# Altium schematic sheet MPU.SchDoc
size A3
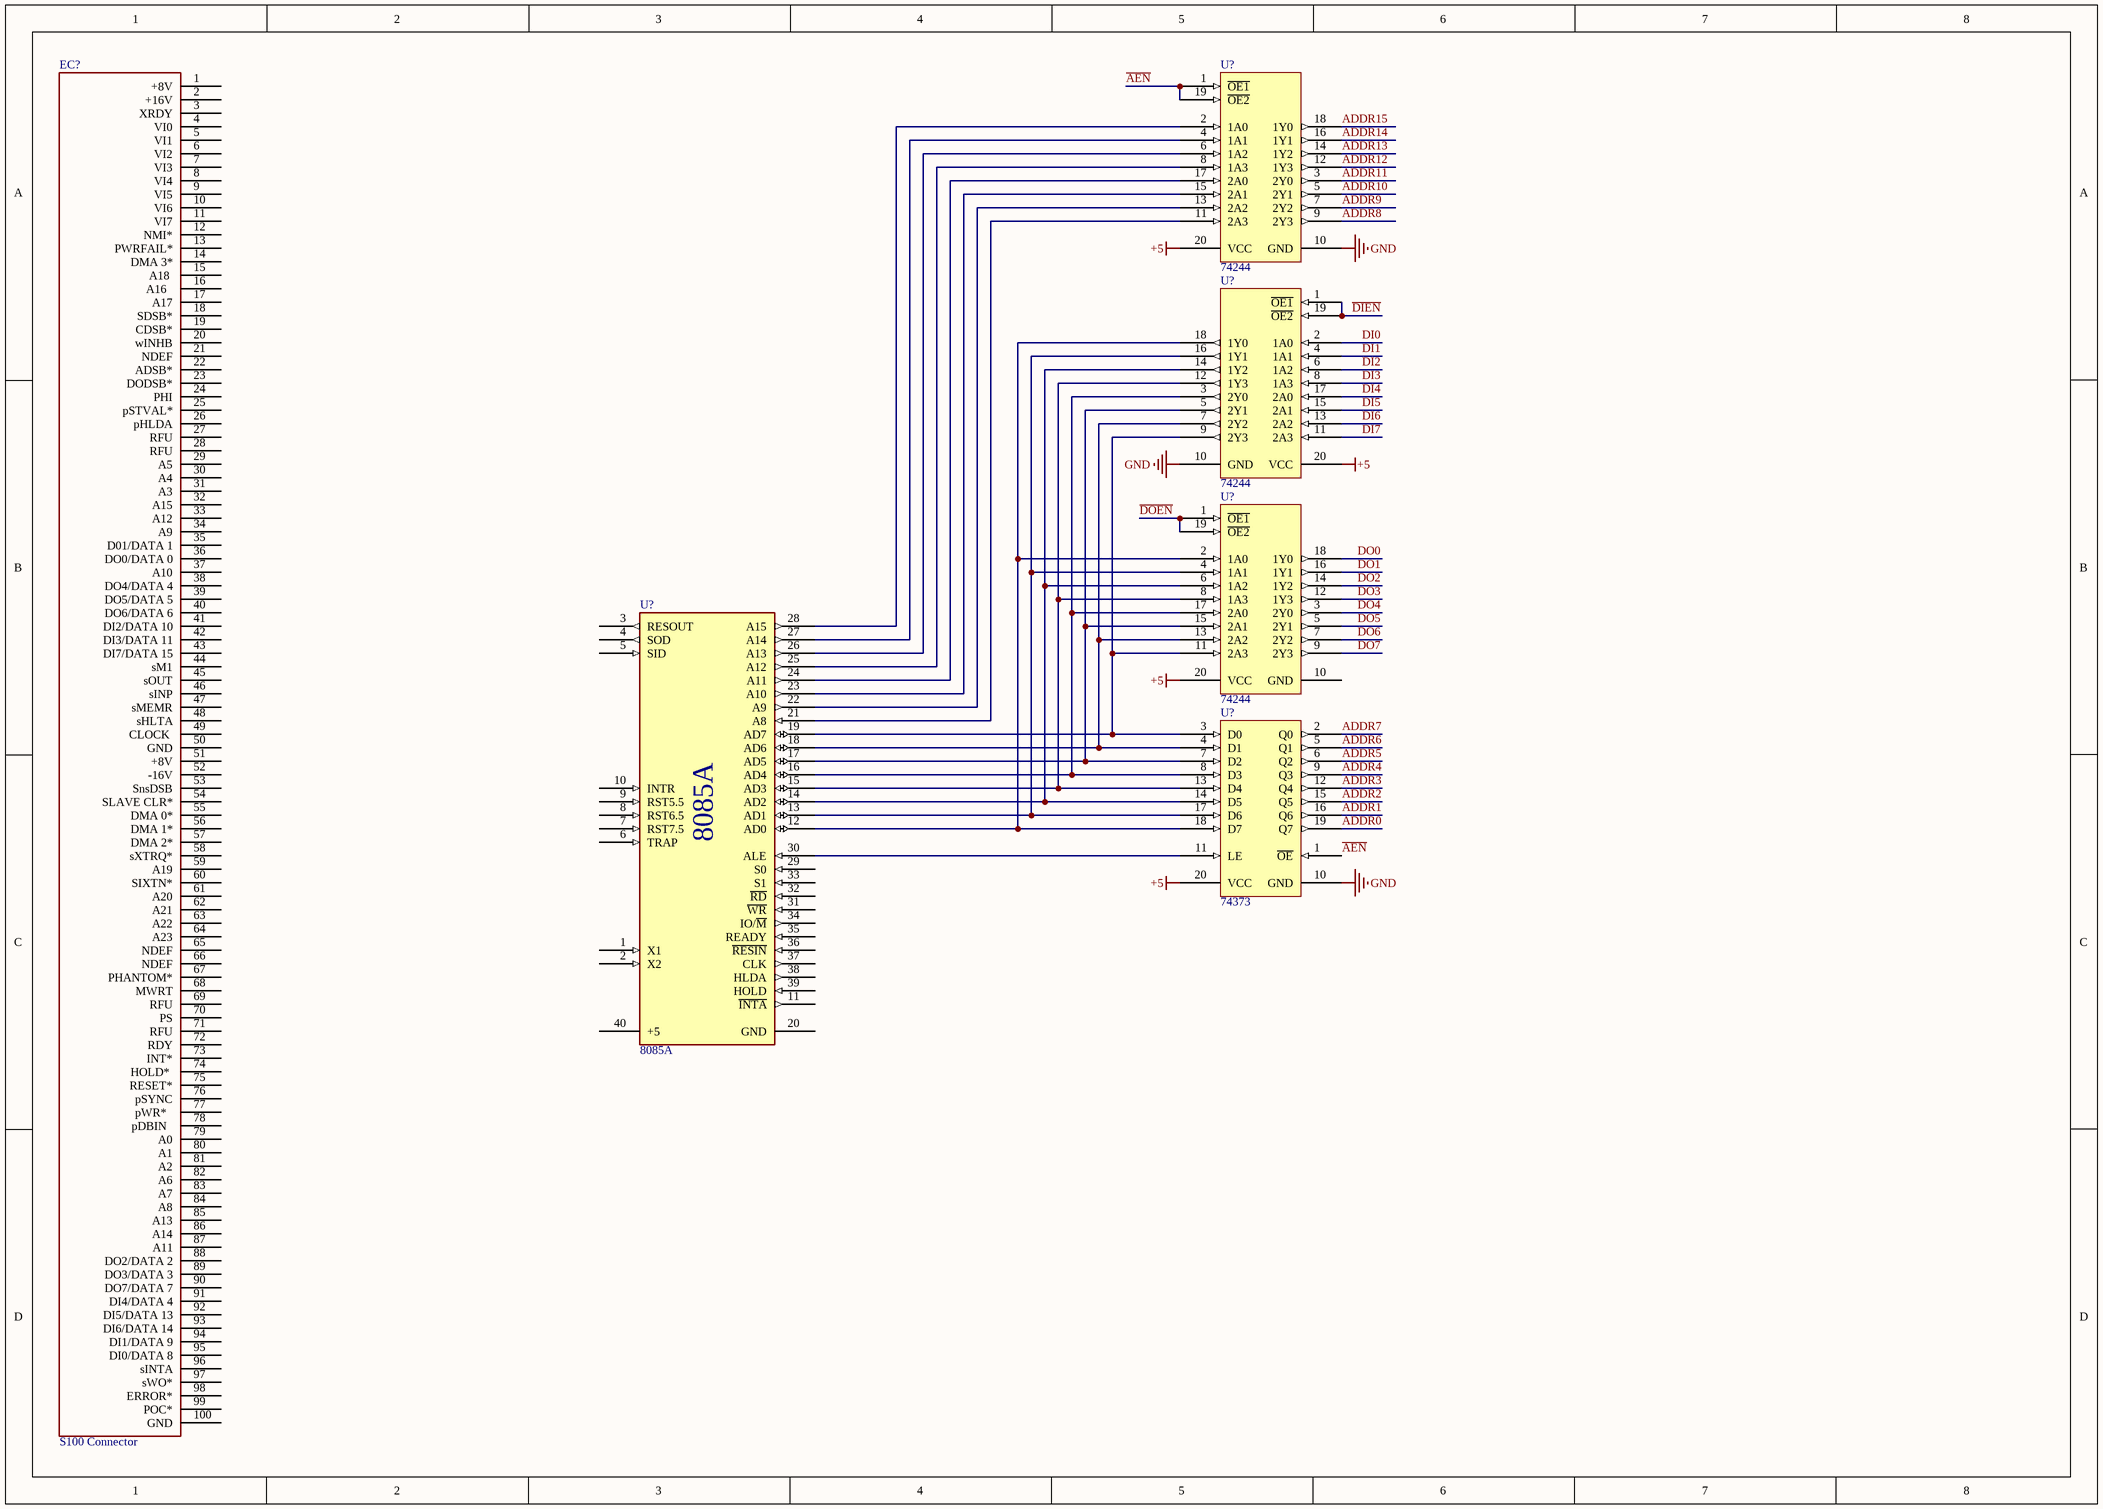
[diagram p0: MPU.SchDoc]

## Parts
(Parts that share a designator on the sheet are numbered #1, #2 ... from top to bottom, then left to right.)
EC?  S100 Connector  [S100]
U?#1  74244  [DIP20]
U?#2  74244  [DIP20]
U?#3  74244  [DIP20]
U?#4  8085A  [DIP-40W]
U?#5  74373  [DIP20]

## Nets
+5: U?#1.20(VCC) U?#2.20(VCC) U?#3.20(VCC) U?#5.20(VCC)
GND: U?#1.10(GND) U?#2.10(GND) U?#5.10(GND)
~{AEN}: U?#1.1(~{OE1}) U?#1.19(~{OE2}) U?#5.1(~{OE})
~{DIEN}: U?#2.1(~{OE1}) U?#2.19(~{OE2})
~{DOEN}: U?#3.1(~{OE1}) U?#3.19(~{OE2})
ADDR0: U?#5.19(Q7)
ADDR1: U?#5.16(Q6)
ADDR2: U?#5.15(Q5)
ADDR3: U?#5.12(Q4)
ADDR4: U?#5.9(Q3)
ADDR5: U?#5.6(Q2)
ADDR6: U?#5.5(Q1)
ADDR7: U?#5.2(Q0)
ADDR8: U?#1.9(2Y3)
ADDR9: U?#1.7(2Y2)
ADDR10: U?#1.5(2Y1)
ADDR11: U?#1.3(2Y0)
ADDR12: U?#1.12(1Y3)
ADDR13: U?#1.14(1Y2)
ADDR14: U?#1.16(1Y1)
ADDR15: U?#1.18(1Y0)
DI0: U?#2.2(1A0)
DI1: U?#2.4(1A1)
DI2: U?#2.6(1A2)
DI3: U?#2.8(1A3)
DI4: U?#2.17(2A0)
DI5: U?#2.15(2A1)
DI6: U?#2.13(2A2)
DI7: U?#2.11(2A3)
DO0: U?#3.18(1Y0)
DO1: U?#3.16(1Y1)
DO2: U?#3.14(1Y2)
DO3: U?#3.12(1Y3)
DO4: U?#3.3(2Y0)
DO5: U?#3.5(2Y1)
DO6: U?#3.7(2Y2)
DO7: U?#3.9(2Y3)
NetU?#1_2: U?#1.2(1A0) U?#4.28(A15)
NetU?#1_4: U?#1.4(1A1) U?#4.27(A14)
NetU?#1_6: U?#1.6(1A2) U?#4.26(A13)
NetU?#1_8: U?#1.8(1A3) U?#4.25(A12)
NetU?#1_11: U?#1.11(2A3) U?#4.21(A8)
NetU?#1_13: U?#1.13(2A2) U?#4.22(A9)
NetU?#1_15: U?#1.15(2A1) U?#4.23(A10)
NetU?#1_17: U?#1.17(2A0) U?#4.24(A11)
NetU?#2_3: U?#2.3(2Y0) U?#3.17(2A0) U?#4.16(AD4) U?#5.8(D3)
NetU?#2_5: U?#2.5(2Y1) U?#3.15(2A1) U?#4.17(AD5) U?#5.7(D2)
NetU?#2_7: U?#2.7(2Y2) U?#3.13(2A2) U?#4.18(AD6) U?#5.4(D1)
NetU?#2_9: U?#2.9(2Y3) U?#3.11(2A3) U?#4.19(AD7) U?#5.3(D0)
NetU?#2_12: U?#2.12(1Y3) U?#3.8(1A3) U?#4.15(AD3) U?#5.13(D4)
NetU?#2_14: U?#2.14(1Y2) U?#3.6(1A2) U?#4.14(AD2) U?#5.14(D5)
NetU?#2_16: U?#2.16(1Y1) U?#3.4(1A1) U?#4.13(AD1) U?#5.17(D6)
NetU?#2_18: U?#2.18(1Y0) U?#3.2(1A0) U?#4.12(AD0) U?#5.18(D7)
NetU?#4_30: U?#4.30(ALE) U?#5.11(LE)

Not connected (* = marked no-connect by the designer): EC? 1(+8V) 2(+16V) 3(XRDY) 4(VI0) 5(VI1) 6(VI2) 7(VI3) 8(VI4) 9(VI5) 10(VI6) 11(VI7) 12(NMI*) 13(PWRFAIL*) 14(DMA_3*) 15(A18 ) 16(A16  ) 17(A17) 18(SDSB*) 19(CDSB*) 20(wINHB) 21(NDEF) 22(ADSB*) 23(DODSB*) 24(PHI) 25(pSTVAL*) 26(pHLDA) 27(RFU) 28(RFU) 29(A5) 30(A4) 31(A3) 32(A15) 33(A12) 34(A9) 35(D01/DATA_1) 36(DO0/DATA_0) 37(A10) 38(DO4/DATA_4) 39(DO5/DATA_5) 40(DO6/DATA_6) 41(DI2/DATA_10) 42(DI3/DATA_11) 43(DI7/DATA_15) 44(sM1) 45(sOUT) 46(sINP) 47(sMEMR) 48(sHLTA) 49(CLOCK ) 50(GND) 51(+8V) 52(-16V) 53(SnsDSB) 54(SLAVE_CLR*) 55(DMA_0*) 56(DMA_1*) 57(DMA_2*) 58(sXTRQ*) 59(A19) 60(SIXTN*) 61(A20) 62(A21) 63(A22) 64(A23) 65(NDEF) 66(NDEF) 67(PHANTOM*) 68(MWRT) 69(RFU) 70(PS) 71(RFU) 72(RDY) 73(INT*) 74(HOLD* ) 75(RESET*) 76(pSYNC) 77(pWR*  ) 78(pDBIN  ) 79(A0) 80(A1) 81(A2) 82(A6) 83(A7) 84(A8) 85(A13) 86(A14) 87(A11) 88(DO2/DATA_2) 89(DO3/DATA_3) 90(DO7/DATA_7) 91(DI4/DATA_4) 92(DI5/DATA_13) 93(DI6/DATA_14) 94(DI1/DATA_9) 95(DI0/DATA_8) 96(sINTA) 97(sWO*) 98(ERROR*) 99(POC*) 100(GND); U?#3 10(GND); U?#4 1(X1) 2(X2) 3(RESOUT) 4(SOD) 5(SID) 6(TRAP) 7(RST7.5) 8(RST6.5) 9(RST5.5) 10(INTR) 11(~{INTA}) 20(GND) 29(S0) 31(~{WR}) 32(~{RD}) 33(S1) 34(IO/~{M}) 35(READY) 36(~{RESIN}) 37(CLK) 38(HLDA) 39(HOLD) 40(+5)

## Library data of the parts
U?#1-U?#3 = 74-244
U?#4 = 8085A: Intel 8085 A Microprocessor 3MHz
U?#5 = 74HC373